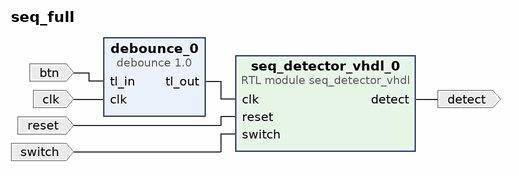
[diagram p0: block diagram of the top level]
# Vivado block design seq_full, xc7a35tcpg236-1, Vivado 2018.2
create_bd_design seq_full

create_bd_port -dir I btn
create_bd_port -dir I -type ce clk
create_bd_port -dir I -type rst reset
set_property -dict {CONFIG.POLARITY ACTIVE_HIGH} [get_bd_ports reset]
create_bd_port -dir I switch
create_bd_port -dir O detect

create_bd_cell -type ip -vlnv FIT:user:debounce:1.0 debounce_0
create_bd_cell -type module -reference seq_detector_vhdl seq_detector_vhdl_0

# ---- connections ----

connect_bd_net -net tl_in_0_1 [get_bd_ports btn] [get_bd_pins debounce_0/tl_in]
connect_bd_net [get_bd_ports clk] [get_bd_pins debounce_0/clk]
connect_bd_net [get_bd_pins debounce_0/tl_out] [get_bd_pins seq_detector_vhdl_0/clk]
connect_bd_net [get_bd_ports reset] [get_bd_pins seq_detector_vhdl_0/reset]
connect_bd_net [get_bd_ports switch] [get_bd_pins seq_detector_vhdl_0/switch]
connect_bd_net [get_bd_pins seq_detector_vhdl_0/detect] [get_bd_ports detect]

validate_bd_design
save_bd_design
